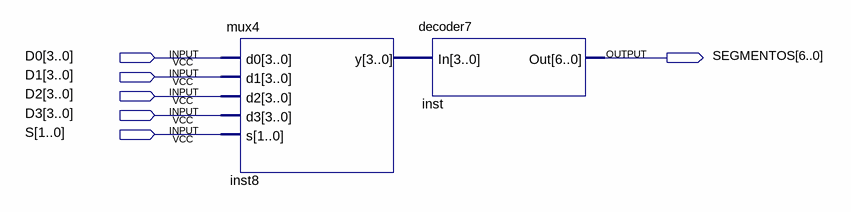
[diagram p0: schematic sheet]
// Quartus schematic mux_7seg.bdf as structural Verilog: 2 symbols, 6 pins
module mux_7seg (
  input  [3:0] D0,
  input  [3:0] D1,
  input  [3:0] D2,
  input  [3:0] D3,
  input  [1:0] S,
  output [6:0] SEGMENTOS
);

  wire [3:0] inst8_y;

  mux4 inst8 (.d0(D0), .d1(D1), .d2(D2), .d3(D3), .s(S), .y(inst8_y));
  decoder7 inst (.In(inst8_y), .Out(SEGMENTOS));
endmodule
